# EAGLE schematic headstage-64 (EAGLE 8.3.2)
DESIGNER: JON NEWMAN, JAKOB VOIGTS; DESIGN_NAME: HEADSTAGE-64; LICENSE: CC BY-NC-SA 4.0; REVISION: 1.4
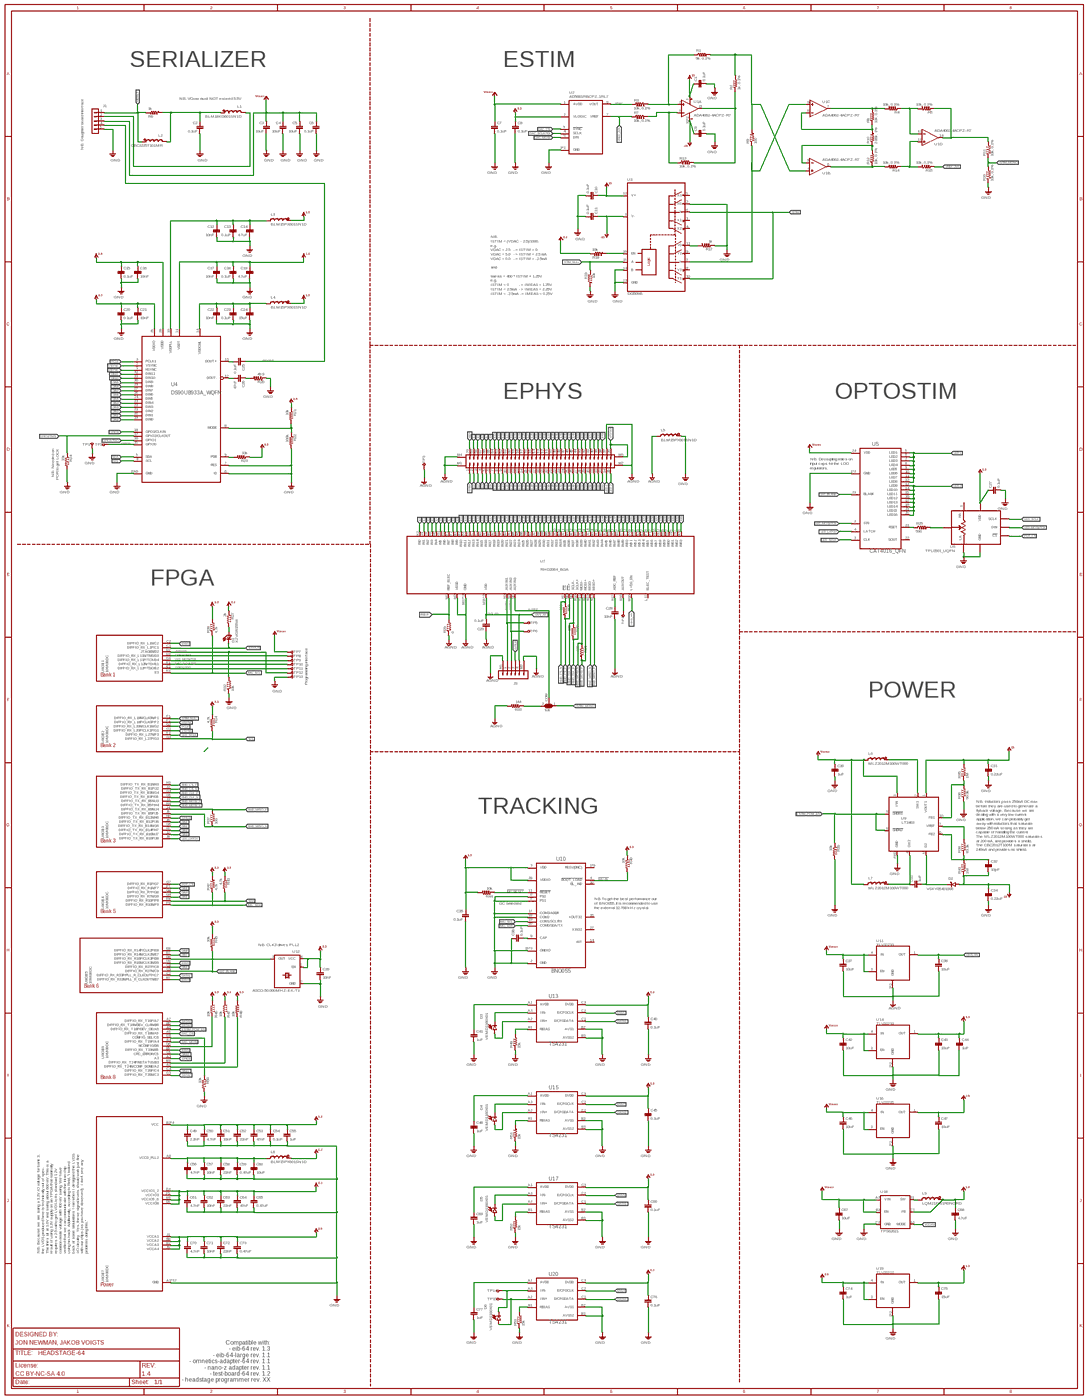
[diagram p0: schematic, sheet 1, overview]
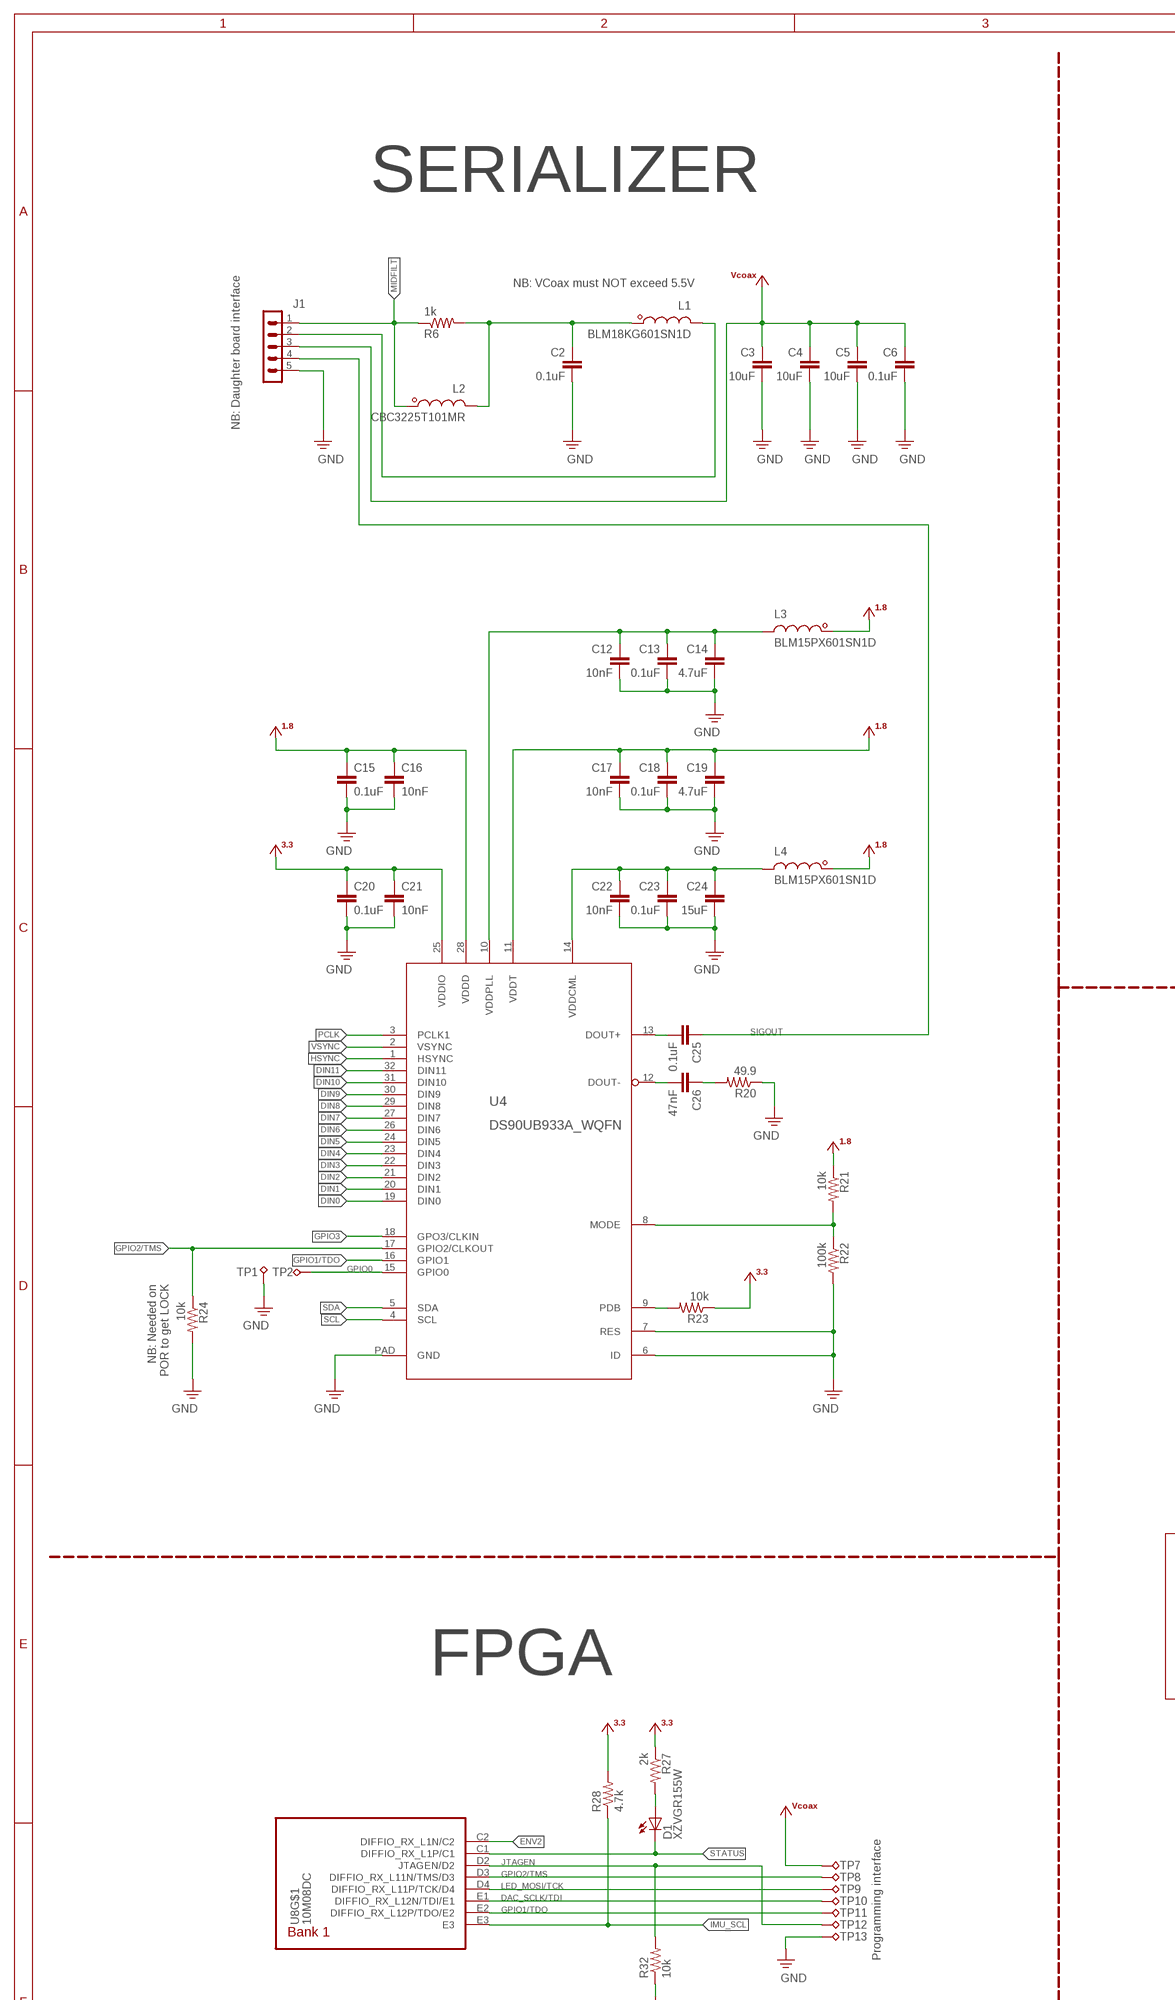
[diagram p1: schematic, sheet 1, part 1 of 4]
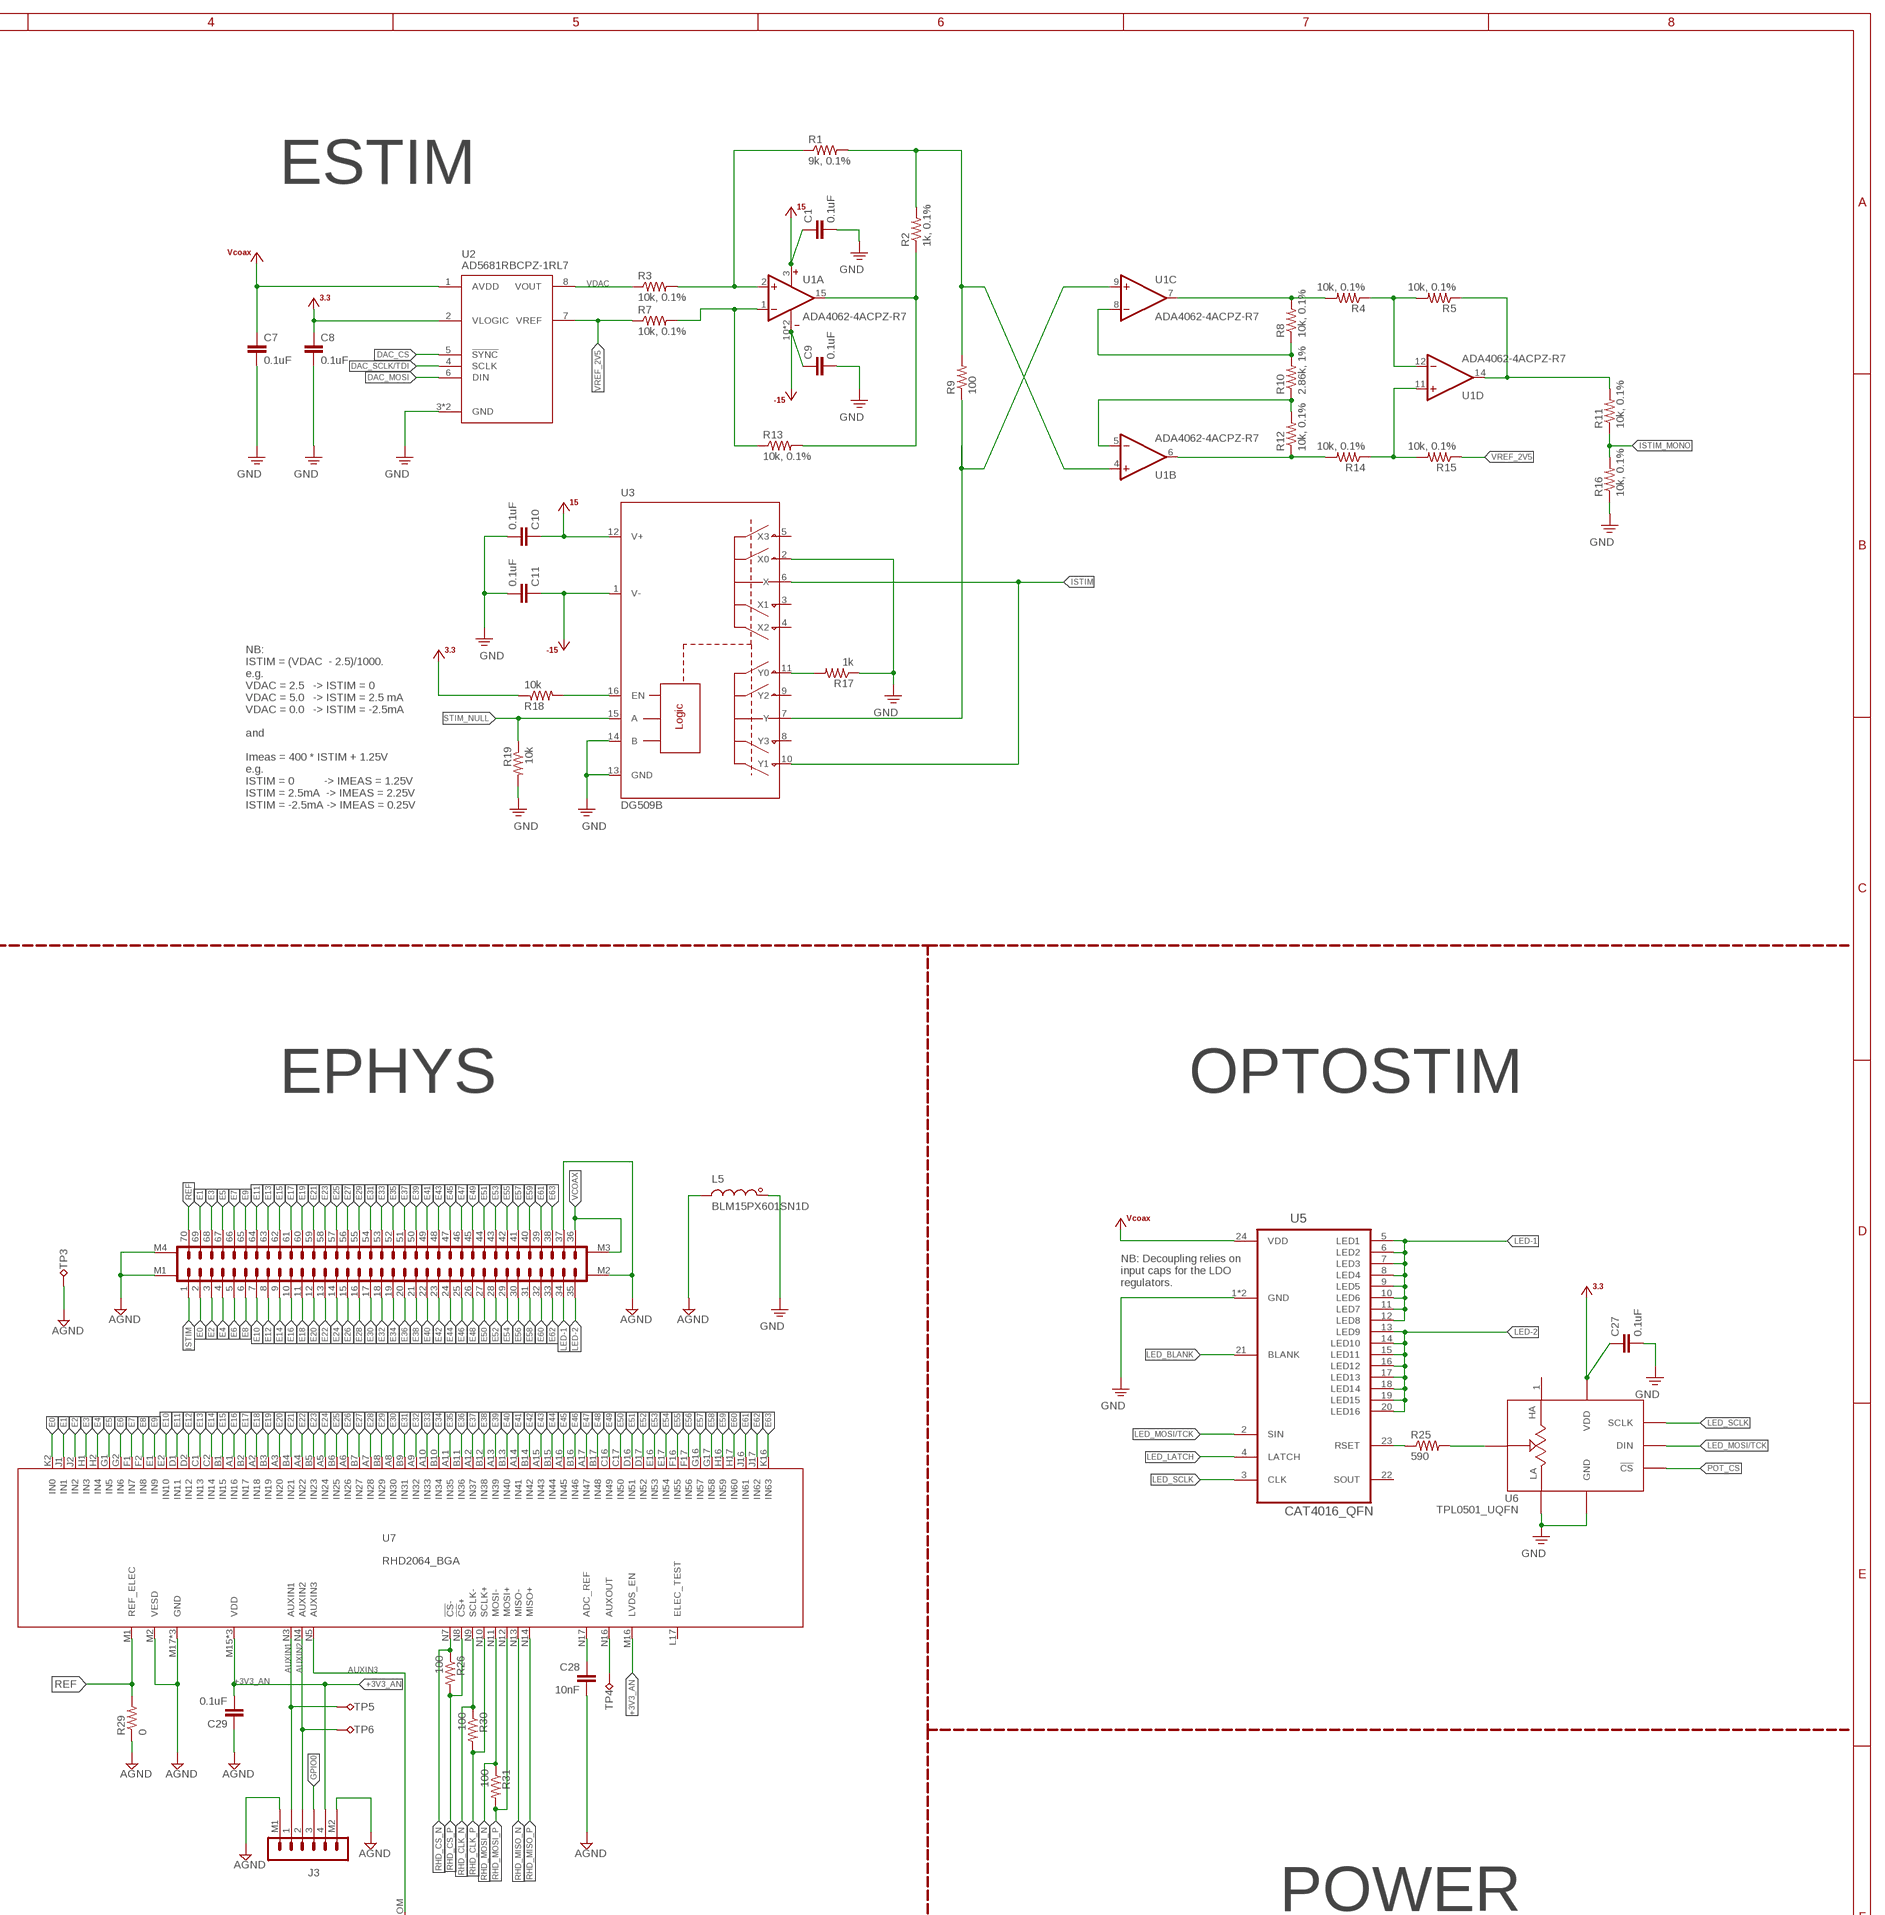
[diagram p2: schematic, sheet 1, part 2 of 4]
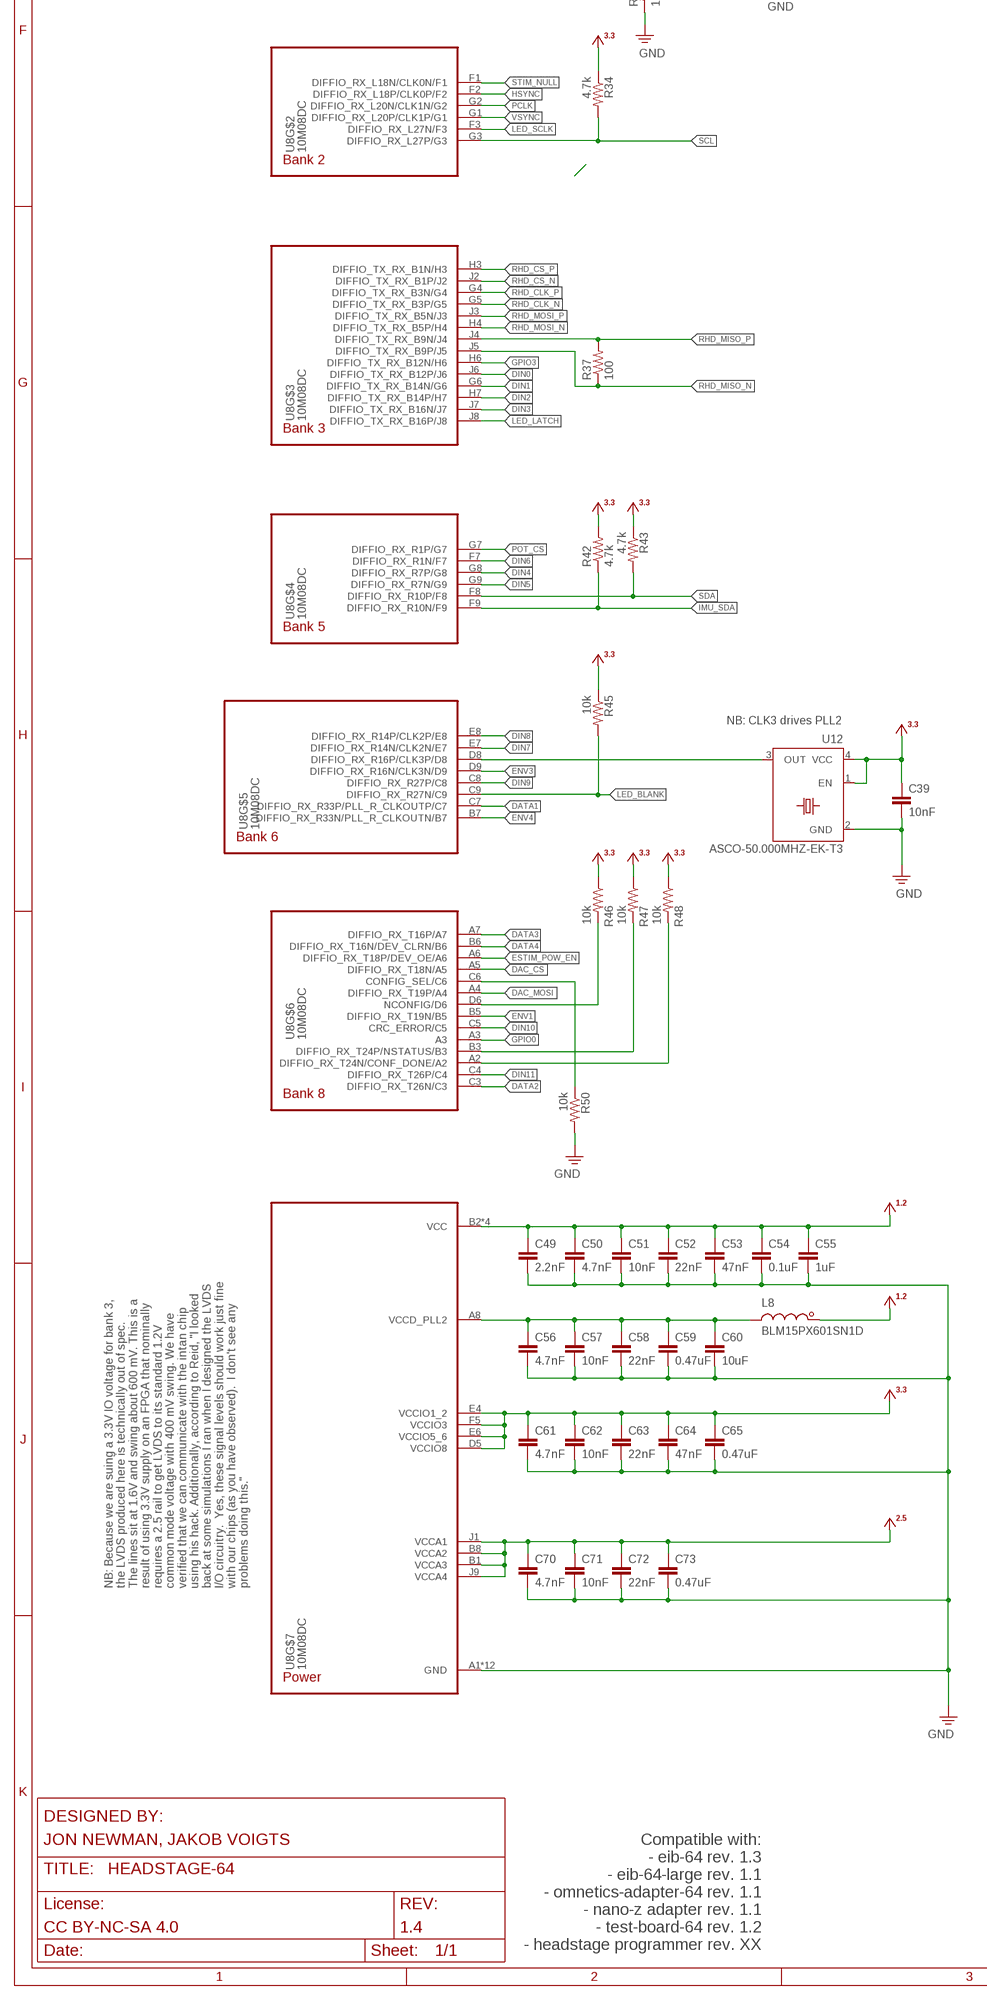
[diagram p3: schematic, sheet 1, part 3 of 4]
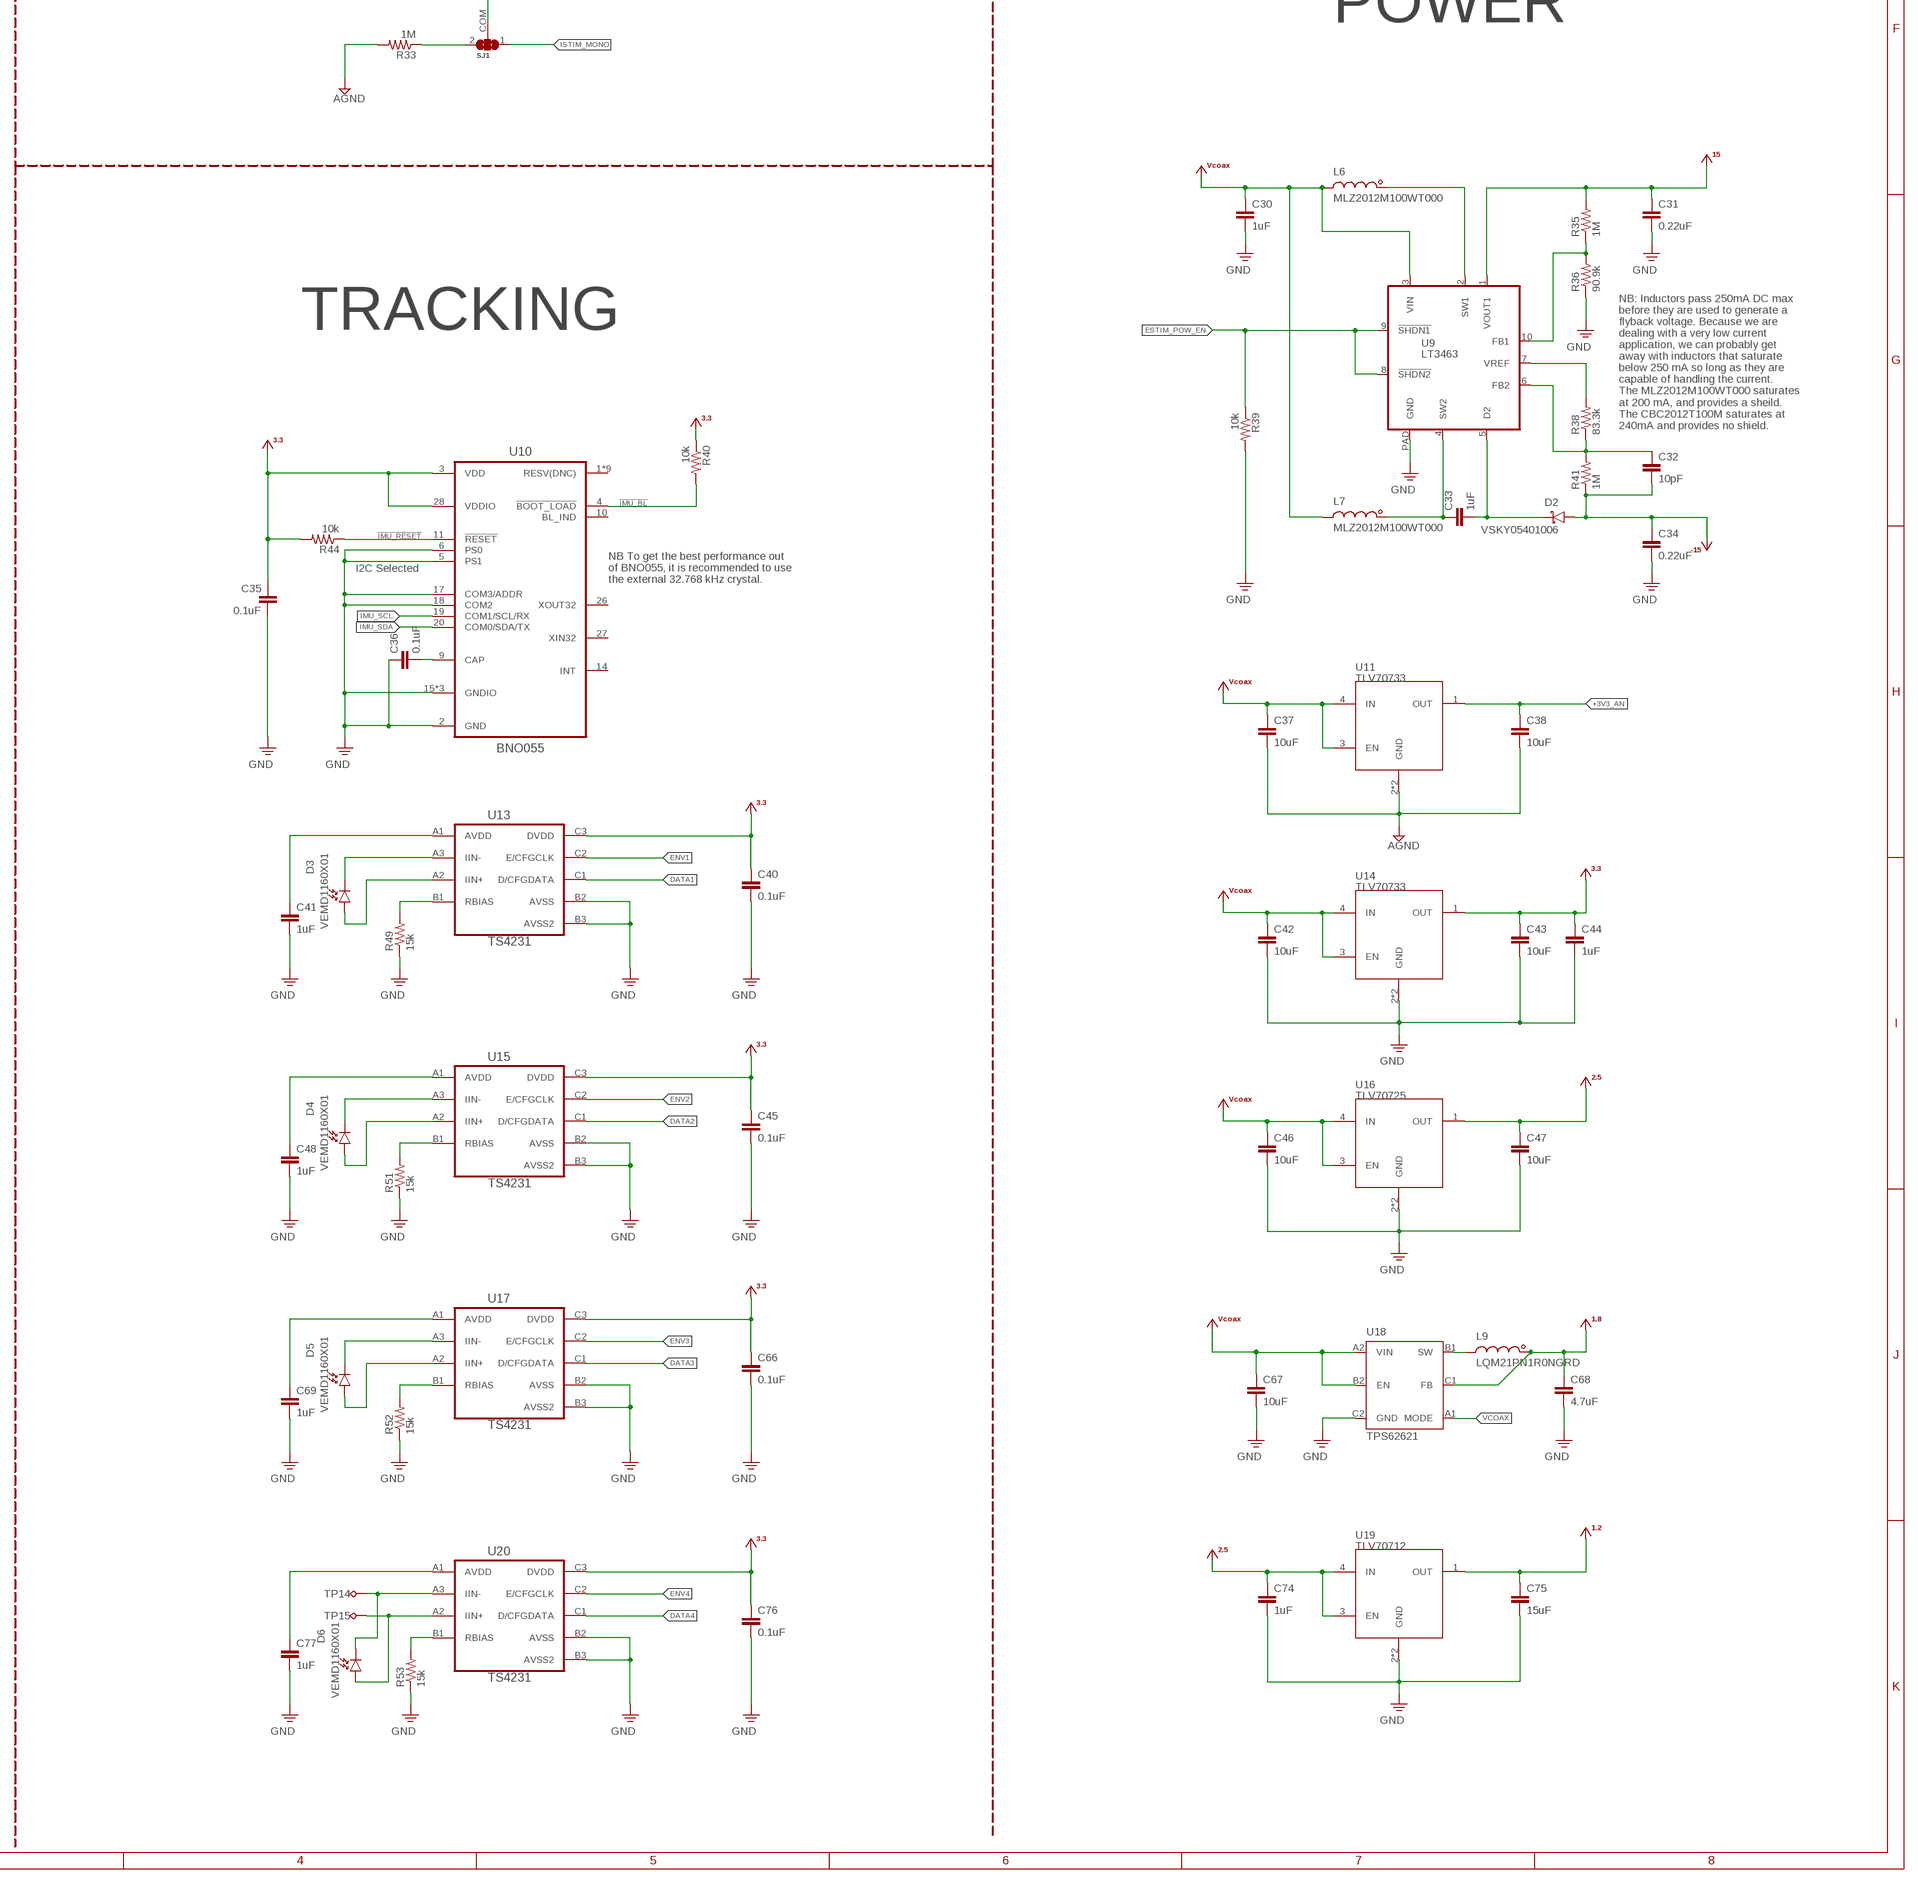
[diagram p4: schematic, sheet 1, part 4 of 4]

## Parts
C1  0.1uF  C_0201T  [0201T]
C2  0.1uF  C_0201T  [0201T]
C3  10uF  C_0402T  [0402T]
C4  10uF  C_0402T  [0402T]
C5  10uF  C_0402T  [0402T]
C6  0.1uF  C_0201T  [0201T]
C7  0.1uF  C_0201T  [0201T]
C8  0.1uF  C_0201T  [0201T]
C9  0.1uF  C_0201T  [0201T]
C10  0.1uF  C_0201T  [0201T]
C11  0.1uF  C_0201T  [0201T]
C12  10nF  C_0201T  [0201T]
C13  0.1uF  C_0201T  [0201T]
C14  4.7uF  C_0402T  [0402T]
C15  0.1uF  C_0201T  [0201T]
C16  10nF  C_0201T  [0201T]
C17  10nF  C_0201T  [0201T]
C18  0.1uF  C_0201T  [0201T]
C19  4.7uF  C_0402T  [0402T]
C20  0.1uF  C_0201T  [0201T]
C21  10nF  C_0201T  [0201T]
C22  10nF  C_0201T  [0201T]
C23  0.1uF  C_0201T  [0201T]
C24  15uF  C_0402T  [0402T]
C25  0.1uF  C_0201T  [0201T]
C26  47nF  C_0201T  [0201T]
C27  0.1uF  C_0201T  [0201T]
C28  10nF  C_0201T  [0201T]
C29  0.1uF  C_0201T  [0201T]
C30  1uF  C_0402T  [0402T]
C31  0.22uF  C_0402T  [0402T]
C32  10pF  C_0201T  [0201T]
C33  1uF  C_0402T  [0402T]
C34  0.22uF  C_0402T  [0402T]
C35  0.1uF  C_0201T  [0201T]
C36  0.1uF  C_0201T  [0201T]
C37  10uF  C_0402T  [0402T]
C38  10uF  C_0402T  [0402T]
C39  10nF  C_0201T  [0201T]
C40  0.1uF  C_0201T  [0201T]
C41  1uF  C_0201T  [0201T]
C42  10uF  C_0402T  [0402T]
C43  10uF  C_0402T  [0402T]
C44  1uF  C_0201T  [0201T]
C45  0.1uF  C_0201T  [0201T]
C46  10uF  C_0402T  [0402T]
C47  10uF  C_0402T  [0402T]
C48  1uF  C_0201T  [0201T]
C49  2.2nF  C_0201T  [0201T]
C50  4.7nF  C_0201T  [0201T]
C51  10nF  C_0201T  [0201T]
C52  22nF  C_0201T  [0201T]
C53  47nF  C_0201T  [0201T]
C54  0.1uF  C_0201T  [0201T]
C55  1uF  C_0201T  [0201T]
C56  4.7nF  C_0201T  [0201T]
C57  10nF  C_0201T  [0201T]
C58  22nF  C_0201T  [0201T]
C59  0.47uF  C_0201T  [0201T]
C60  10uF  C_0402T  [0402T]
C61  4.7nF  C_0201T  [0201T]
C62  10nF  C_0201T  [0201T]
C63  22nF  C_0201T  [0201T]
C64  47nF  C_0201T  [0201T]
C65  0.47uF  C_0201T  [0201T]
C66  0.1uF  C_0201T  [0201T]
C67  10uF  C_0402T  [0402T]
C68  4.7uF  C_0402T  [0402T]
C69  1uF  C_0201T  [0201T]
C70  4.7nF  C_0201T  [0201T]
C71  10nF  C_0201T  [0201T]
C72  22nF  C_0201T  [0201T]
C73  0.47uF  C_0201T  [0201T]
C74  1uF  C_0402T  [0402T]
C75  15uF  C_0402T  [0402T]
C76  0.1uF  C_0201T  [0201T]
C77  1uF  C_0201T  [0201T]
D1  XZVGR155W  LED_0201T  [LED-0201T]
D2  VSKY05401006  S-DIODE_CLP1006-2L  [CLP1006-2L]
D3  VEMD1160X01  PHOTODIODE_0805PT  [0805PT]
D4  VEMD1160X01  PHOTODIODE_0805PT  [0805PT]
D5  VEMD1160X01  PHOTODIODE_0805PT  [0805PT]
D6  VEMD1160X01  PHOTODIODE_0805PT  [0805PT]
J1  PINHD-1X5_HEADSTAGE-64-REV1.4-DAUGHTER-CARD  [HEADSTAGE-64-REV1.4-DAUGHTER-CARD]
J2  DF40C-70DP-0.4V(51)  PINHD-2X35+4DF40-70HEAD-LESS-SILK  [DF40-70HEAD-LESS-SILK]
J3  DF40C-10DP-0.4V(51)  PINHD-1X5_HALF_CONNECTOR  [DF40-10HEAD_HALF]
L1  BLM18KG601SN1D  L_0603T  [0603T]
L2  CBC3225T101MR  L_1210T  [1210T]
L3  BLM15PX601SN1D  L_0402T  [0402T]
L4  BLM15PX601SN1D  L_0402T  [0402T]
L5  BLM15PX601SN1D  L_0402T  [0402T]
L6  MLZ2012M100WT000  L_0805T  [0805T]
L7  MLZ2012M100WT000  L_0805T  [0805T]
L8  BLM15PX601SN1D  L_0402T  [0402T]
L9  LQM21PN1R0NGRD  L_0805T  [0805T]
R1  9k, 0.1%  R_0201T  [0201T]
R2  1k, 0.1%  R_0201T  [0201T]
R3  10k, 0.1%  R_0201T  [0201T]
R4  10k, 0.1%  R_0201T  [0201T]
R5  10k, 0.1%  R_0201T  [0201T]
R6  1k  R_0201T  [0201T]
R7  10k, 0.1%  R_0201T  [0201T]
R8  10k, 0.1%  R_0201T  [0201T]
R9  100  R_0201T  [0201T]
R10  2.86k, 1%  R_0201T  [0201T]
R11  10k, 0.1%  R_0201T  [0201T]
R12  10k, 0.1%  R_0201T  [0201T]
R13  10k, 0.1%  R_0201T  [0201T]
R14  10k, 0.1%  R_0201T  [0201T]
R15  10k, 0.1%  R_0201T  [0201T]
R16  10k, 0.1%  R_0201T  [0201T]
R17  1k  R_0201T  [0201T]
R18  10k  R_0201T  [0201T]
R19  10k  R_0201T  [0201T]
R20  49.9  R_0201T  [0201T]
R21  10k  R_0201T  [0201T]
R22  100k  R_0201T  [0201T]
R23  10k  R_0201T  [0201T]
R24  10k  R_0201T  [0201T]
R25  590  R_0201T  [0201T]
R26  100  R_0201T  [0201T]
R27  2k  R_0201T  [0201T]
R28  4.7k  R_0201T  [0201T]
R29  0  R_0201T  [0201T]
R30  100  R_0201T  [0201T]
R31  100  R_0201T  [0201T]
R32  10k  R_0201T  [0201T]
R33  1M  R_0201T  [0201T]
R34  4.7k  R_0201T  [0201T]
R35  1M  R_0201T  [0201T]
R36  90.9k  R_0201T  [0201T]
R37  100  R_0201T  [0201T]
R38  83.3k  R_0201T  [0201T]
R39  10k  R_0201T  [0201T]
R40  10k  R_0201T  [0201T]
R41  1M  R_0201T  [0201T]
R42  4.7k  R_0201T  [0201T]
R43  4.7k  R_0201T  [0201T]
R44  10k  R_0201T  [0201T]
R45  10k  R_0201T  [0201T]
R46  10k  R_0201T  [0201T]
R47  10k  R_0201T  [0201T]
R48  10k  R_0201T  [0201T]
R49  15k  R_0201T  [0201T]
R50  10k  R_0201T  [0201T]
R51  15k  R_0201T  [0201T]
R52  15k  R_0201T  [0201T]
R53  15k  R_0201T  [0201T]
SJ1  SJ2_0201T  [SJ_2_0201_T]
TP1  TPTP09R  [TP09R]
TP2  TPTP09R  [TP09R]
TP3  VCC  TPTP07R  [TP07R]
TP4  VCC  TPTP07R  [TP07R]
TP5  VCC  TPTP07R  [TP07R]
TP6  VCC  TPTP07R  [TP07R]
TP7  TPTP06R  [TP06R]
TP8  TPTP06R  [TP06R]
TP9  TPTP06R  [TP06R]
TP10  TPTP06R  [TP06R]
TP11  TPTP06R  [TP06R]
TP12  gnd  TPTP06R  [TP06R]
TP13  VCC  TPTP06R  [TP06R]
TP14  TPTP06R  [TP06R]
TP15  TPTP06R  [TP06R]
U1  ADA4062-4ACPZ-R7  QUAD-OPAMP_14PIN_CP_16_27_L  [CP_16_27-L]
U2  AD5681RBCPZ-1RL7  AD5683-VLOGIC_CP_8_10-L  [CP_8_10-L]
U3  DG509B  MUX_2X4:1_DG509B-MQFN  [MQFN16-1.8X2.6]
U4  DS90UB933A_WQFN  DS90UB913A_WQFN  [WQFN32-5X5]
U5  CAT4016_QFN  [QFN24-4X4]
U6  TPL0501_UQFN  [UQFN]
U7  RHD2064_BGA  RHD2164_BGA_BGA  [BGA104_0.5MM]
U8  10M08DC  10M08DC_VBGA  [VBGA81-4X4]
U9  LT3463  [DFN103X3]
U10  BNO055  [LGA-28-3.8X5.2]
U11  TLV70733  TLV707  [X2SON]
U12  ASCO-50.000MHZ-EK-T3  CRYSTAL-OSC_ASCO  [ASCO]
U13  TS4231  [WLCSP3X3]
U14  TLV70733  TLV707  [X2SON]
U15  TS4231  [WLCSP3X3]
U16  TLV70725  TLV707  [X2SON]
U17  TS4231  [WLCSP3X3]
U18  TPS62621  TPS6262X  [XBGA6_1.2X0.8]
U19  TLV70712  TLV707  [X2SON]
U20  TS4231  [WLCSP3X3]

## Nets
!IMU_BL: R40.2 U10.4(!BOOT_LOAD)
!IMU_RESET: R44.1 U10.11(!RESET)
$N324: C56.1 C57.1 C58.1 C59.1 C60.1 L8.2 U8.A8(VCCD_PLL2)
+1V2: C49.1 C50.1 C51.1 C52.1 C53.1 C54.1 C55.1 C75.1 L8.1 U8.B2(VCC) U8.B9(VCC) U8.H2(VCC) U8.H8(VCC) U19.1(OUT)
+1V8: C15.1 C16.1 C17.1 C18.1 C19.1 C68.1 L3.1 L4.1 L9.1 R21.1 U4.11(VDDT) U4.28(VDDD) U18.C1(FB)
+2V5: C47.1 C70.1 C71.1 C72.1 C73.1 C74.1 U8.B1(VCCA3) U8.B8(VCCA2) U8.J1(VCCA1) U8.J9(VCCA4) U16.1(OUT) U19.3(EN) U19.4(IN)
+3V3: C8.1 C20.1 C21.1 C27.1 C35.1 C39.1 C40.1 C43.1 C44.1 C45.1 C61.1 C62.1 C63.1 C64.1 C65.1 C66.1 C76.1 R18.1 R23.1 R27.1 R28.2 R34.1 R40.1 R42.2 R43.1 R44.2 R45.1 R46.1 R47.1 R48.1 U2.2(VLOGIC) U4.25(VDDIO) U6.7(VDD) U8.D5(VCCIO8) U8.E4(VCCIO1_2) U8.E6(VCCIO5_6) U8.F5(VCCIO3) U10.3(VDD) U10.28(VDDIO) U12.1(EN) U12.4(VCC) U13.C3(DVDD) U14.1(OUT) U15.C3(DVDD) U17.C3(DVDD) U20.C3(DVDD)
+3V3_AN: C29.2 C38.1 J3.4 U7.M15(VDD) U7.M16(LVDS_EN) U7.N2(VDD) U7.N15(VDD) U11.1(OUT)
+15V0: C1.1 C10.1 C31.1 R35.2 U1.3(P:V+) U3.12(V+) U9.1(VOUT1) ; supply symbol labelled +15V
-15V0: C9.1 C11.1 C32.2 C34.1 D2.A R41.1 U1.10(P:V-) U1.PAD(P:V-) U3.1(V-) ; supply symbol labelled -15V
AGND: C28.2 C29.1 C37.2 C38.2 J2.37 J2.M1 J2.M2 J2.M4 J3.M1 J3.M2 L5.2 R29.1 R33.2 TP3.TP U7.M2(VESD) U7.M17(GND) U7.N1(GND) U7.N6(GND) U11.2(GND) U11.PAD(GND)
AUXIN1: J3.1 TP5.TP U7.N3(AUXIN1)
AUXIN2: J3.2 TP6.TP U7.N4(AUXIN2)
AUXIN3: SJ1.COM U7.N5(AUXIN3)
CONF_DONE: R48.2 U8.A2(DIFFIO_RX_T24N/CONF_DONE/A2)
CONFIG_SEL: R50.1 U8.C6(CONFIG_SEL/C6)
DAC_CS: U2.5(!SYNC) U8.A5(DIFFIO_RX_T18N/A5)
DAC_MOSI: U2.6(DIN) U8.A4(DIFFIO_RX_T19P/A4)
DAC_SCLK/TDI: TP10.TP U2.4(SCLK) U8.E1(DIFFIO_RX_L12N/TDI/E1)
DATA1: U8.C7(DIFFIO_RX_R33P/PLL_R_CLKOUTP/C7) U13.C1(D/CFGDATA)
DATA2: U8.C3(DIFFIO_RX_T26N/C3) U15.C1(D/CFGDATA)
DATA3: U8.A7(DIFFIO_RX_T16P/A7) U17.C1(D/CFGDATA)
DATA4: U8.B6(DIFFIO_RX_T16N/DEV_CLRN/B6) U20.C1(D/CFGDATA)
DIN0: U4.19(DIN0) U8.J6(DIFFIO_TX_RX_B12P/J6)
DIN1: U4.20(DIN1) U8.G6(DIFFIO_TX_RX_B14N/G6)
DIN2: U4.21(DIN2) U8.H7(DIFFIO_TX_RX_B14P/H7)
DIN3: U4.22(DIN3) U8.J7(DIFFIO_TX_RX_B16N/J7)
DIN4: U4.23(DIN4) U8.G8(DIFFIO_RX_R7P/G8)
DIN5: U4.24(DIN5) U8.G9(DIFFIO_RX_R7N/G9)
DIN6: U4.26(DIN6) U8.F7(DIFFIO_RX_R1N/F7)
DIN7: U4.27(DIN7) U8.E7(DIFFIO_RX_R14N/CLK2N/E7)
DIN8: U4.29(DIN8) U8.E8(DIFFIO_RX_R14P/CLK2P/E8)
DIN9: U4.30(DIN9) U8.C8(DIFFIO_RX_R27P/C8)
DIN10: U4.31(DIN10) U8.C5(CRC_ERROR/C5)
DIN11: U4.32(DIN11) U8.C4(DIFFIO_RX_T26P/C4)
E0: J2.2 U7.K2(IN0)
E1: J2.69 U7.J1(IN1)
E2: J2.3 U7.J2(IN2)
E3: J2.68 U7.H1(IN3)
E4: J2.4 U7.H2(IN4)
E5: J2.67 U7.G1(IN5)
E6: J2.5 U7.G2(IN6)
E7: J2.66 U7.F1(IN7)
E8: J2.6 U7.F2(IN8)
E9: J2.65 U7.E1(IN9)
E10: J2.7 U7.E2(IN10)
E11: J2.64 U7.D1(IN11)
E12: J2.8 U7.D2(IN12)
E13: J2.63 U7.C1(IN13)
E14: J2.9 U7.C2(IN14)
E15: J2.62 U7.B1(IN15)
E16: J2.10 U7.A1(IN16)
E17: J2.61 U7.B2(IN17)
E18: J2.11 U7.A2(IN18)
E19: J2.60 U7.B3(IN19)
E20: J2.12 U7.A3(IN20)
E21: J2.59 U7.B4(IN21)
E22: J2.13 U7.A4(IN22)
E23: J2.58 U7.B5(IN23)
E24: J2.14 U7.A5(IN24)
E25: J2.57 U7.B6(IN25)
E26: J2.15 U7.A6(IN26)
E27: J2.56 U7.B7(IN27)
E28: J2.16 U7.A7(IN28)
E29: J2.55 U7.B8(IN29)
E30: J2.17 U7.A8(IN30)
E31: J2.54 U7.B9(IN31)
E32: J2.18 U7.A9(IN32)
E33: J2.53 U7.A10(IN33)
E34: J2.19 U7.B10(IN34)
E35: J2.52 U7.A11(IN35)
E36: J2.20 U7.B11(IN36)
E37: J2.51 U7.A12(IN37)
E38: J2.21 U7.B12(IN38)
E39: J2.50 U7.A13(IN39)
E40: J2.22 U7.B13(IN40)
E41: J2.49 U7.A14(IN41)
E42: J2.23 U7.B14(IN42)
E43: J2.48 U7.A15(IN43)
E44: J2.24 U7.B15(IN44)
E45: J2.47 U7.A16(IN45)
E46: J2.25 U7.B16(IN46)
E47: J2.46 U7.A17(IN47)
E48: J2.26 U7.B17(IN48)
E49: J2.45 U7.C16(IN49)
E50: J2.27 U7.C17(IN50)
E51: J2.44 U7.D16(IN51)
E52: J2.28 U7.D17(IN52)
E53: J2.43 U7.E16(IN53)
E54: J2.29 U7.E17(IN54)
E55: J2.42 U7.F16(IN55)
E56: J2.30 U7.F17(IN56)
E57: J2.41 U7.G16(IN57)
E58: J2.31 U7.G17(IN58)
E59: J2.40 U7.H16(IN59)
E60: J2.32 U7.H17(IN60)
E61: J2.39 U7.J16(IN61)
E62: J2.33 U7.J17(IN62)
E63: J2.38 U7.K16(IN63)
ENV1: U8.B5(DIFFIO_RX_T19N/B5) U13.C2(E/CFGCLK)
ENV2: U8.C2(DIFFIO_RX_L1N/C2) U15.C2(E/CFGCLK)
ENV3: U8.D9(DIFFIO_RX_R16N/CLK3N/D9) U17.C2(E/CFGCLK)
ENV4: U8.B7(DIFFIO_RX_R33N/PLL_R_CLKOUTN/B7) U20.C2(E/CFGCLK)
ESTIM_POW_EN: R39.1 U8.A6(DIFFIO_RX_T18P/DEV_OE/A6) U9.8(!SHDN2) U9.9(!SHDN1)
GND: C1.2 C2.2 C3.2 C4.2 C5.2 C6.2 C7.2 C8.2 C9.2 C10.2 C11.2 C12.2 C13.2 C14.2 C15.2 C16.2 C17.2 C18.2 C19.2 C20.2 C21.2 C22.2 C23.2 C24.2 C27.2 C30.2 C31.2 C34.2 C35.2 C36.1 C39.2 C40.2 C41.2 C42.2 C43.2 C44.2 C45.2 C46.2 C47.2 C48.2 C49.2 C50.2 C51.2 C52.2 C53.2 C54.2 C55.2 C56.2 C57.2 C58.2 C59.2 C60.2 C61.2 C62.2 C63.2 C64.2 C65.2 C66.2 C67.2 C68.2 C69.2 C70.2 C71.2 C72.2 C73.2 C74.2 C75.2 C76.2 C77.2 J1.5 L5.1 R16.1 R17.1 R19.2 R20.1 R22.2 R24.2 R32.1 R36.1 R39.2 R49.1 R50.2 R51.1 R52.1 R53.1 TP1.TP TP13.TP U2.3(GND) U2.PAD(GND) U3.2(X0) U3.13(GND) U3.14(B) U4.6(ID) U4.7(RES) U4.PAD(GND) U5.1(GND) U5.PAD(GND) U6.4(GND) U6.8(LA) U8.A1(GND) U8.A9(GND) U8.B4(GND) U8.D1(GND) U8.D7(GND) U8.E5(GND) U8.E9(GND) U8.F4(GND) U8.F6(GND) U8.H1(GND) U8.H5(GND) U8.H9(GND) U9.PAD(GND) U10.2(GND) U10.5(PS1) U10.6(PS0) U10.15(GNDIO) U10.16(GNDIO) U10.17(COM3/ADDR) U10.18(COM2) U10.25(GNDIO) U12.2(GND) U13.B2(AVSS) U13.B3(AVSS2) U14.2(GND) U14.PAD(GND) U15.B2(AVSS) U15.B3(AVSS2) U16.2(GND) U16.PAD(GND) U17.B2(AVSS) U17.B3(AVSS2) U18.C2(GND) U19.2(GND) U19.PAD(GND) U20.B2(AVSS) U20.B3(AVSS2)
GPIO0: J3.3 TP2.TP U4.15(GPIO0) U8.A3
GPIO1/TDO: TP11.TP U4.16(GPIO1) U8.E2(DIFFIO_RX_L12P/TDO/E2)
GPIO2/TMS: R24.1 TP8.TP U4.17(GPIO2/CLKOUT) U8.D3(DIFFIO_RX_L11N/TMS/D3)
GPIO3: U4.18(GPO3/CLKIN) U8.H6(DIFFIO_TX_RX_B12N/H6)
HSYNC: U4.1(HSYNC) U8.F2(DIFFIO_RX_L18P/CLK0P/F2)
IMU_SCL: R28.1 U8.E3 U10.19(COM1/SCL/RX)
IMU_SDA: R42.1 U8.F9(DIFFIO_RX_R10N/F9) U10.20(COM0/SDA/TX)
ISTIM: J2.1 U3.6(X) U3.10(Y1)
ISTIM_MONO: R11.1 R16.2 SJ1.1
ISTIM_PRE: R9.1 U1.9(C:+IN) U3.7(Y)
JTAGEN: R32.2 TP12.TP U8.D2(JTAGEN/D2)
LED-1: J2.34 U5.5(LED1) U5.6(LED2) U5.7(LED3) U5.8(LED4) U5.9(LED5) U5.10(LED6) U5.11(LED7) U5.12(LED8)
LED-2: J2.35 U5.13(LED9) U5.14(LED10) U5.15(LED11) U5.16(LED12) U5.17(LED13) U5.18(LED14) U5.19(LED15) U5.20(LED16)
LED_BLANK: R45.2 U5.21(BLANK) U8.C9(DIFFIO_RX_R27N/C9)
LED_LATCH: U5.4(LATCH) U8.J8(DIFFIO_TX_RX_B16P/J8)
LED_MOSI/TCK: TP9.TP U5.2(SIN) U6.2(DIN) U8.D4(DIFFIO_RX_L11P/TCK/D4)
LED_SCLK: U5.3(CLK) U6.5(SCLK) U8.F3(DIFFIO_RX_L27N/F3)
MIDFILT: J1.1 L2.1 R6.1
N$1: R25.2 U6.6(WA)
N$2: C33.1 L7.1 U9.4(SW2)
N$3: C32.1 R38.1 R41.2 U9.6(FB2)
N$4: D3.C U13.A3(IIN-)
N$5: D3.A U13.A2(IIN+)
N$6: R49.2 U13.B1(RBIAS)
N$7: C41.1 U13.A1(AVDD)
N$8: L6.1 U9.2(SW1)
N$9: D4.C U15.A3(IIN-)
N$10: D4.A U15.A2(IIN+)
N$11: R51.2 U15.B1(RBIAS)
N$12: C48.1 U15.A1(AVDD)
N$13: C2.1 L1.1 L2.2 R6.2
N$14: R25.1 U5.23(RSET)
N$15: D5.C U17.A3(IIN-)
N$16: D5.A U17.A2(IIN+)
N$17: R52.2 U17.B1(RBIAS)
N$18: C69.1 U17.A1(AVDD)
N$19: C33.2 D2.C U9.5(D2)
N$20: R1.2 R2.2 R9.2 U1.4(B:+IN)
N$21: J1.2 L1.2
N$22: R33.1 SJ1.2
N$23: R17.2 U3.11(Y0)
N$24: R35.1 R36.2 U9.10(FB1)
N$26: D6.C TP14.TP U20.A3(IIN-)
N$27: R38.2 U9.7(VREF)
N$28: C25.2 U4.13(DOUT+)
N$29: D1.2(A) R27.2
N$30: R23.2 U4.9(PDB)
N$31: C26.2 U4.12(DOUT-)
N$32: C26.1 R20.2
N$33: R21.2 R22.1 U4.8(MODE)
N$34: C12.1 C13.1 C14.1 L3.2 U4.10(VDDPLL)
N$35: C22.1 C23.1 C24.1 L4.2 U4.14(VDDCML)
N$36: C28.1 U7.N17(ADC_REF)
N$37: U8.D8(DIFFIO_RX_R16P/CLK3P/D8) U12.3(OUT)
N$38: D6.A TP15.TP U20.A2(IIN+)
N$39: TP4.TP U7.N16(AUXOUT)
N$41: R53.2 U20.B1(RBIAS)
N$42: C77.1 U20.A1(AVDD)
N$44: R18.2 U3.16(EN)
N$45: R46.2 U8.D6(NCONFIG/D6)
N$46: L9.2 U18.B1(SW)
N$53: R1.1 R3.2 U1.2(A:+IN)
N$54: R7.2 R13.1 U1.1(A:-IN)
N$55: R2.1 R13.2 U1.15(A:OUT)
N$57: R12.1 R14.2 U1.6(B:OUT)
N$59: R10.1 R12.2 U1.5(B:-IN)
N$60: R8.1 R10.2 U1.8(C:-IN)
N$61: R4.2 R8.2 U1.7(C:OUT)
N$62: R5.1 R11.2 U1.14(D:OUT)
N$63: R4.1 R5.2 U1.12(D:-IN)
N$64: R14.1 R15.2 U1.11(D:+IN)
N$67: C36.2 U10.9(CAP)
NSTATUS: R47.2 U8.B3(DIFFIO_RX_T24P/NSTATUS/B3)
PCLK: U4.3(PCLK1) U8.G2(DIFFIO_RX_L20N/CLK1N/G2)
POT_CS: U6.3(!CS) U8.G7(DIFFIO_RX_R1P/G7)
REF: J2.70 R29.2 U7.M1(REF_ELEC)
RHD_CLK_N [diff]: R30.1 U7.N9(SCLK-) U8.G5(DIFFIO_TX_RX_B3P/G5)
RHD_CLK_P [diff]: R30.2 U7.N10(SCLK+) U8.G4(DIFFIO_TX_RX_B3N/G4)
RHD_CS_N [diff]: R26.1 U7.N7(!CS!-) U8.J2(DIFFIO_TX_RX_B1P/J2)
RHD_CS_P [diff]: R26.2 U7.N8(!CS!+) U8.H3(DIFFIO_TX_RX_B1N/H3)
RHD_MISO_N [diff]: R37.1 U7.N13(MISO-) U8.J5(DIFFIO_TX_RX_B9P/J5)
RHD_MISO_P [diff]: R37.2 U7.N14(MISO+) U8.J4(DIFFIO_TX_RX_B9N/J4)
RHD_MOSI_N [diff]: R31.1 U7.N11(MOSI-) U8.H4(DIFFIO_TX_RX_B5P/H4)
RHD_MOSI_P [diff]: R31.2 U7.N12(MOSI+) U8.J3(DIFFIO_TX_RX_B5N/J3)
SCL: R34.2 U4.4(SCL) U8.G3(DIFFIO_RX_L27P/G3)
SDA: R43.2 U4.5(SDA) U8.F8(DIFFIO_RX_R10P/F8)
SIGOUT: C25.1 J1.4
STATUS: D1.1(C) U8.C1(DIFFIO_RX_L1P/C1)
STIM_NULL: R19.1 U3.15(A) U8.F1(DIFFIO_RX_L18N/CLK0N/F1)
VCOAX: C3.1 C4.1 C5.1 C6.1 C7.1 C30.1 C37.1 C42.1 C46.1 C67.1 J1.3 J2.36 J2.M3 L6.2 L7.2 TP7.TP U2.1(AVDD) U5.24(VDD) U9.3(VIN) U11.3(EN) U11.4(IN) U14.3(EN) U14.4(IN) U16.3(EN) U16.4(IN) U18.A1(MODE) U18.A2(VIN) U18.B2(EN) ; supply symbol labelled +VCOAX
VDAC: R3.1 U2.8(VOUT)
VREF_2V5: R7.1 R15.1 U2.7(VREF)
VSYNC: U4.2(VSYNC) U8.G1(DIFFIO_RX_L20P/CLK1P/G1)
Unconnected: U3.3(X1) U3.4(X2) U3.5(X3) U3.8(Y3) U3.9(Y2) U5.22(SOUT) U6.1(HA) U7.L17(ELEC_TEST) U10.1(RESV(DNC)) U10.7(RESV(DNC)) U10.8(RESV(DNC)) U10.10(BL_IND) U10.12(RESV(DNC)) U10.13(RESV(DNC)) U10.14(INT) U10.21(RESV(DNC)) U10.22(RESV(DNC)) U10.23(RESV(DNC)) U10.24(RESV(DNC)) U10.26(XOUT32) U10.27(XIN32)

## Notes on the sheet
- SERIALIZER | ESTIM
- NB: VCoax must NOT exceed 5.5V
- NB: Daughter board interface
- NB:
  ISTIM = (VDAC  - 2.5)/1000.
  e.g. 
  VDAC = 2.5   -> ISTIM = 0
  VDAC = 5.0   -> ISTIM = 2.5 mA
  VDAC = 0.0   -> ISTIM = -2.5mA
  
  and
  
  Imeas = 400 * ISTIM + 1.25V
  e.g. 
  ISTIM = 0          -> IMEAS = 1.25V
  ISTIM = 2.5mA  -> IMEAS = 2.25V
  ISTIM = -2.5mA -> IMEAS = 0.25V
- EPHYS | OPTOSTIM
- NB: Needed on
  POR to get LOCK
- NB: Decoupling relies on 
  input caps for the LDO 
  regulators.
- FPGA
- Programming interface
- POWER
- TRACKING
- NB: Inductors pass 250mA DC max
  before they are used to generate a
  flyback voltage. Because we are
  dealing with a very low current
  application, we can probably get 
  away with inductors that saturate
  below 250 mA so long as they are
  capable of handling the current. 
  The MLZ2012M100WT000 saturates 
  at 200 mA, and provides a sheild. 
  The CBC2012T100M saturates at
  240mA and provides no shield.
- I2C Selected
- NB To get the best performance out
  of BNO055, it is recommended to use
  the external 32.768 kHz crystal.
- NB: CLK3 drives PLL2
- NB: Because we are suing a 3.3V IO voltage for bank 3,
  the LVDS produced here is technically out of spec.
  The lines sit at 1.6V and swing about 600 mV. This is a
  result of using 3.3V supply on an FPGA that nominally
  requires a 2.5 rail to get LVDS to its standard 1.2V
  common mode voltage with 400 mV swing. We have
  verified that we can communicate with the intan chip
  using his hack. Additionally, according to Reid, "I looked
  back at some simulations I ran when I designed the LVDS
  I/O circuitry.  Yes, these signal levels should work just fine
  with our chips (as you have observed).  I don't see any
  problems doing this."
- Compatible with:
  - eib-64 rev. 1.3
  - eib-64-large rev. 1.1
  - omnetics-adapter-64 rev. 1.1
  - nano-z adapter rev. 1.1
  - test-board-64 rev. 1.2
  - headstage programmer rev. XX

## Library data of the parts
C1 = jonnew:C: Capacitor; PARTNP: CL03A104KA3NNNC
C2 C6-C8 C27 C36 C40 C45 C66 C76 = jonnew:C: Capacitor; PARTNO: C0603X5R1C104K030BC
C3-C5 = jonnew:C: Capacitor; PARTNO: CL05A475MO5NUNC
C9-C11 = jonnew:C: Capacitor; PARTNO: CL03A104KA3NNNC
C12 C13 C15-C18 C20-C23 C29 C32 C35 C39 C49-C54 C56-C58 C61-C64 C70-C72 = jonnew:C: Capacitor
C14 C19 = jonnew:C: Capacitor; PARTNO: GRM155R61A475MEAAD
C24 = jonnew:C: Capacitor; PARTNO: CL05A226MQ5QUNC
C25 = jonnew:C: Capacitor; PARTNO: C1005X7R1H104K050BB
C26 = jonnew:C: Capacitor; PARTNO: C1005X7R1H473K050BB
C28 = jonnew:C: Capacitor; PARTNO: GRM033R71E103KE14D
C30 C33 C37 C42 C46 C67 C68 C74 = jonnew:C: Capacitor; PARTNO: CL05A105KO5NNNC
C31 C34 = jonnew:C: Capacitor; PARTNO: UMK105BJ224KV-F
C38 C43 C47 C60 = jonnew:C: Capacitor; PARTNO: CL05A106MQ5NUNC
C41 C44 C48 C55 C69 C77 = jonnew:C: Capacitor; PARTNO: CL03A105MP3ZSNH
C59 C65 C73 = jonnew:C: Capacitor; PARTNO: GRM033R60J474KE90D
C75 = jonnew:C: Capacitor; PARTNO: CL05A226MQ6ZUN8
D1 = jonnew:LED: Surface mount LED
D2 = jonnew:S-DIODE: Schottky Diode
D3-D6 = jonnew:PHOTODIODE
J1 = jonnew:PINHD-1X5
J2 = jonnew:PINHD-2X35+4
J3 = jonnew:PINHD-1X5_HALF_CONNECTOR
L1 L2 L6 L7 L9 = jonnew:L: Inductor
L3-L5 L8 = jonnew:L: Inductor; PARTNO: BLM15PX601SN1D
R1-R53 = jonnew:R: Resistor
SJ1 = jonnew:SJ2: SMD solder JUMPER
TP1-TP15 = jonnew:TP: Test pad
U1 = jonnew:QUAD-OPAMP_14PIN: OP AMP
U2 = jonnew:AD5683-VLOGIC
U3 = jonnew:MUX_2X4:1
U4 = jonnew:DS90UB913A
U5 = jonnew:CAT4016; PARTNO: CAT4016HV6-GT2
U6 = jonnew:TPL0501; PARTNO: TPL0501-100RSER
U7 = jonnew:RHD2164_BGA: Intan Technologies RHD2164 chip
U8 = jonnew:10M08DC
U9 = jonnew:LT3463
U10 = jonnew:BNO055
U11 U14 U16 U19 = jonnew:TLV707
U12 = jonnew:CRYSTAL-OSC
U13 U15 U17 U20 = jonnew:TS4231
U18 = jonnew:TPS6262X

## Net classes
1 thick: width 0.1 mm
2 diff: width 0.076 mm, drill 0.1 mm, clearance 0.051 mm